# EAGLE schematic SimpleCircuit (EAGLE 9.6.2)
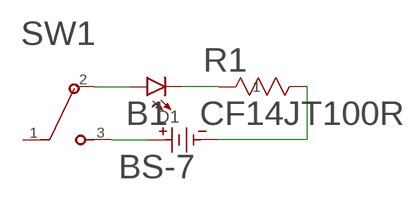
[diagram p0: schematic, sheet 1]

## Parts
B1  BS-7  [BS-7_MPD]
D1  LED3MM  [LED_3MM]
R1  CF14JT100R  [STA_CF14_STP]
SW1  EG1218  [SW_1218_EWI]

## Nets
GND: B1.1 R1.2
N$1: B1.2 SW1.3
N$3: D1.K(C) R1.1
VCC: D1.A SW1.2
Unconnected: SW1.1

## Library data of the parts
B1 = BS-7:BS-7; BUILT_BY: EMA_Cory; COPYRIGHT: Copyright (C) 2018 Accelerated Designs. All rights reserved; DATASHEET: http://www.memoryprotectiondevices.com/datasheets/BS-7-datasheet.pdf; MANUFACTURER_PART_NUMBER: BS-7; SOURCELIBRARY: Memory_Protection_Devices_2020-03-04; VENDOR: Memory Protection Devices, Inc
D1 = SparkFun-LED:LED: LED (Generic) Standard schematic elements and footprints for 5mm, 3mm, 1206, and 0603 sized LEDs. Generic LEDs with no color specified.; PROD_ID: DIO-08794
R1 = 100Resistor:CF14JT100R; BUILT_BY: EMA_UL_Team; MANUFACTURER_PART_NUMBER: CF14JT100R; SOURCELIBRARY: Stackpole_2014-12-31; VENDOR: Stackpole International
SW1 = EG1218:EG1218; BUILT_BY: EMA_Matt; COPYRIGHT: Copyright (C) 2018 Accelerated Designs. All rights reserved; DATASHEET: https://datasheet.octopart.com/EG1218-E-Switch-datasheet-13225248.pdf; MANUFACTURER_PART_NUMBER: EG1218; SOURCELIBRARY: E-Switch_2020-04-02; VENDOR: E-Switch